# EAGLE design weight (EAGLE 9.5.0)
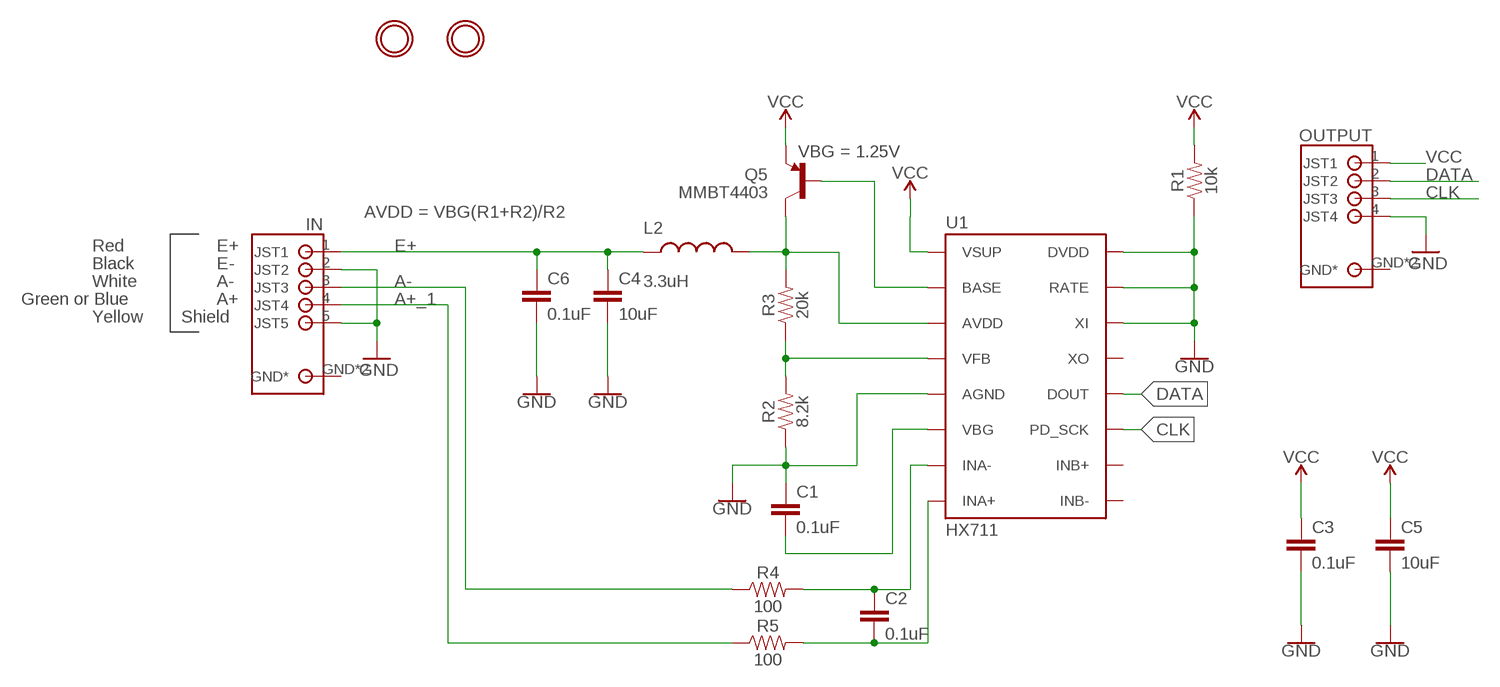
[diagram p0: schematic, sheet 1]

## Parts
C1  0.1uF  0.1UF-0603-25V-(+80/-20%)  [0603]
C2  0.1uF  0.1UF-0603-25V-(+80/-20%)  [0603]
C3  0.1uF  0.1UF-0603-25V-(+80/-20%)  [0603]
C4  10uF  10UF-0603-6.3V-20%  [0603]
C5  10uF  10UF-0603-6.3V-20%  [0603]
C6  0.1uF  0.1UF-0603-25V-(+80/-20%)  [0603]
IN  S5B-PH-SM4_TB  [S5B-PH-SM4_TB]
L2  3.3uH  INDUCTOR0805-IND  [0805]
OUTPUT  S4B-PH-SM4_TB  [S4B-PH-SM4_TB]
Q5  MMBT4403  TRANSISTOR_PNPMMBT4403  [SOT23-3]
R1  10k  10KOHM-0603-1/10W-1%  [0603]
R2  8.2k  8.2KOHM-0603-1/10W-5%  [0603]
R3  20k  20KOHM-0603-1/10W-1%  [0603]
R4  100  100OHM-0603-1/4W-5%  [0603]
R5  100  100OHM-0603-1/4W-5%  [0603]
U1  HX711  [SO16]
U$4  MOUNTINGHOLE2.5  [MOUNTINGHOLE_2.5_PLATED]
U$49  MOUNTINGHOLE2.5  [MOUNTINGHOLE_2.5_PLATED]

## Nets
A+_1: IN.4(JST4) R5.1
A-: IN.3(JST3) R4.1
CLK: OUTPUT.3(JST3) U1.11(PD_SCK)
DATA: OUTPUT.2(JST2) U1.12(DOUT)
E+: C4.1 C6.1 IN.1(JST1) L2.1
GND: C1.1 C3.2 C4.2 C5.2 C6.2 IN.2(JST2) IN.5(JST5) OUTPUT.4(JST4) R1.1 R2.1 U1.5(AGND) U1.14(XI) U1.15(RATE) U1.16(DVDD)
N$1: C2.2 R5.2 U1.8(INA+)
N$7: Q5.1(B) U1.2(BASE)
N$8: R2.2 R3.1 U1.4(VFB)
N$10: C1.2 U1.6(VBG)
N$11: L2.2 Q5.3(C) R3.2 U1.3(AVDD)
N$12: C2.1 R4.2 U1.7(INA-)
VCC: C3.1 C5.1 OUTPUT.1(JST1) Q5.2(E) R1.2 U1.1(VSUP)
Unconnected: IN.GND2(GND*) IN.GND(GND*) OUTPUT.GND2(GND*) OUTPUT.GND(GND*) U1.9(INB-) U1.10(INB+) U1.13(XO)

## Notes on the sheet
- VBG = 1.25V
- AVDD = VBG(R1+R2)/R2
- Red | E+
- Black | E-
- White | A-
- Green or Blue | A+
- Yellow | Shield

## Library data of the parts
C1-C3 C6 = SparkFun-Capacitors:0.1UF: 0.1µF ceramic capacitors A capacitor is a passive two-terminal electrical component used to store electrical energy temporarily in an electric field.; PROD_ID: CAP-00810
C4 C5 = SparkFun-Capacitors:10UF: 10.0µF ceramic capacitors A capacitor is a passive two-terminal electrical component used to store electrical energy temporarily in an electric field.; PROD_ID: CAP-11015
IN = NewKevinMade:S5B-PH-SM4_TB
L2 = SparkFun-Passives:INDUCTOR: Inductors Basic Inductor/Choke - 0603 and 1206. Footprints are not proven and vary greatly between part numbers. INDUCTOR POWER 3.3UH 4.0A SMD 0.197" L x 0.197" W x 0.177" H (5.00mm x 5.00mm x 4.50mm); PROD_ID: NDUC-13076
OUTPUT = NewKevinMade:S4B-PH-SM4_TB
Q5 = SparkFun-DiscreteSemi:TRANSISTOR_PNP: Generic PNP BJT Double check pinouts against datasheets- not all devices are the same! MMBT3906 - 40V 200mA SOT-23 (TRANS-08052) MMBT4403 - 40V 600mA SOT-23 (TRANS-09245); PROD_ID: TRANS-09245
R1 = SparkFun-Resistors:10KOHM: 10kΩ resistor A resistor is a passive two-terminal electrical component that implements electrical resistance as a circuit element. Resistors act to reduce current flow, and, at the same time, act to lower voltage levels within circuits. - Wikipedia; PROD_ID: RES-00824
R2 = SparkFun-Resistors:8.2KOHM: 8.2kΩ resistor A resistor is a passive two-terminal electrical component that implements electrical resistance as a circuit element. Resistors act to reduce current flow, and, at the same time, act to lower voltage levels within circuits. - Wikipedia; PROD_ID: RES-10646
R3 = SparkFun-Resistors:20KOHM: 20kΩ resistor A resistor is a passive two-terminal electrical component that implements electrical resistance as a circuit element. Resistors act to reduce current flow, and, at the same time, act to lower voltage levels within circuits. - Wikipedia; PROD_ID: RES-09383
R4 R5 = SparkFun-Resistors:100OHM: 100Ω resistor A resistor is a passive two-terminal electrical component that implements electrical resistance as a circuit element. Resistors act to reduce current flow, and, at the same time, act to lower voltage levels within circuits. - Wikipedia; PROD_ID: RES-12438
U1 = SparkFun-IC-Conversion:HX711: AVIA Semiconductor HX711 - ADC 24-Bit Analog-to-Digital Converter for Weigh Scales Datasheet <https://cdn.sparkfun.com/datasheets/Sensors/ForceFlex/hx711_english.pdf> SparkFun Products: SparkFun Load Cell Amplifier - HX711 <https://www.sparkfun.com/products/13879>; PROD_ID: IC-12445
U$4 U$49 = microbuilder:MOUNTINGHOLE: Mounting Hole For #2 screws (0.086"/2.18mm width, 0.094"/2.4mm hole) use 2.5mm; BOM: EXCLUDE

## Net classes
2 Power: width 0.203 mm, drill 0.203 mm, clearance 0.203 mm
3 HighSpeedSig: width 0.152 mm, drill 0.152 mm, clearance 0.203 mm
5 LowPower: width 0.203 mm, drill 0.203 mm, clearance 0.203 mm

## Board
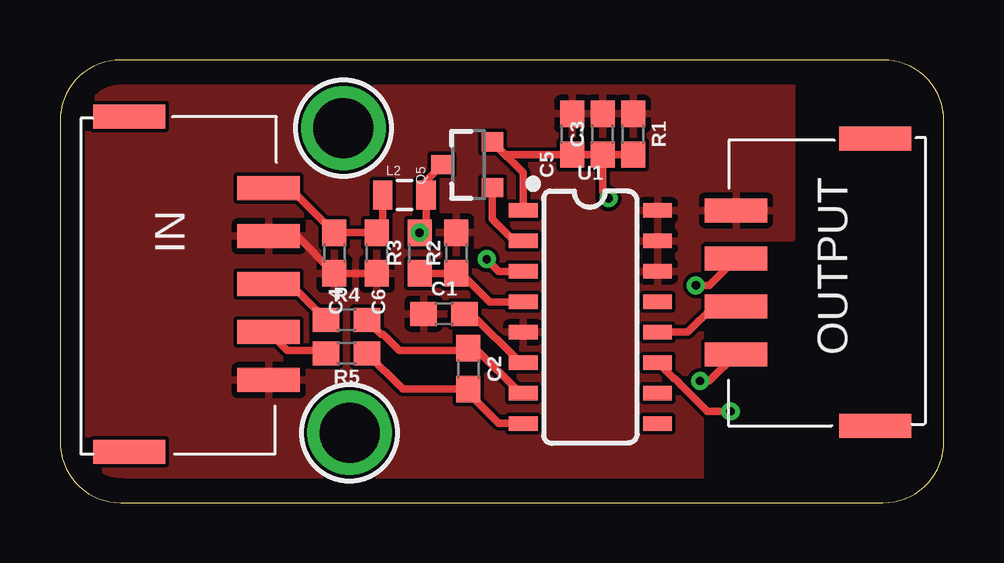
[diagram p1: board, top side]
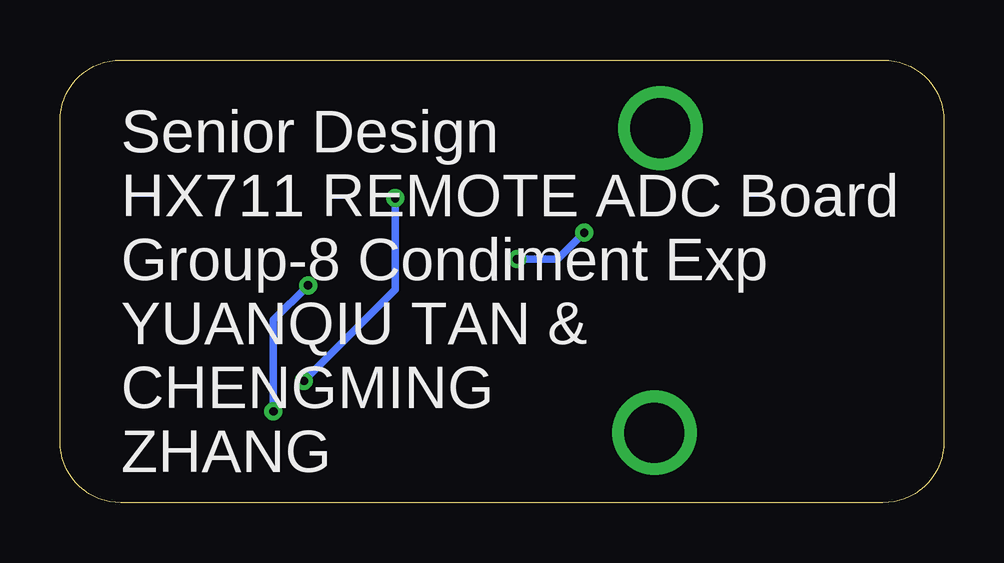
[diagram p2: board, bottom side, seen from below]

Size 36.83 x 18.47 mm. Coordinates in mm from the lower left corner, seen from the top.
Outline: 0,15.93 0,2.54 arc90 2.54,0 34.29,0 arc90 36.83,2.54 36.83,15.93 arc90 34.29,18.47 2.54,18.47 arc90 0,15.93
Copper layers (1*16): Top 0.035mm / dielectric 1.5mm / Bottom 0.035mm
Design rules "default": minimum track width 6mil, minimum drill 0.35mm, track to track 6mil, track to pad 6mil, pad to pad 6mil, via to via 6mil, smd to smd 6mil, copper to edge 40mil, drill to drill 6mil, minimum pad ring 10mil, minimum via ring 8mil, stop-mask expansion 4mil, vias tented up to drill 0mil, thermal gap 10mil

### Footprints (pad centres in the part's own frame; a part is rotated, then mirrored left to right if it is on the bottom)
0603 = smd 1.1 x 1: 1 -0.85,0; 2 0.85,0
S5B-PH-SM4_TB = smd 1 x 2.6: 1 4.92,9.33; 2 6.92,9.33; 3 8.92,9.33; 4 10.92,9.33; 5 12.92,9.33 | smd 1 x 3: GND 1.936,3.53; GND2 15.904,3.53
0805 = smd 0.8 x 1.2: 1 -0.9,0; 2 0.9,0
S4B-PH-SM4_TB = smd 1 x 2.6: 1 3.27,7.9; 2 5.27,7.9; 3 7.27,7.9; 4 9.27,7.9 | smd 1 x 3: GND 0.286,2.1; GND2 12.254,2.1
SOT23-3 = smd 0.8 x 0.9: 1 -0.95,-1; 2 0.95,-1; 3 0,1.1
SO16 = smd 0.6 x 1.2: 1 -4.445,-2.8; 2 -3.175,-2.8; 3 -1.905,-2.8; 4 -0.635,-2.8; 5 0.635,-2.8; 6 1.905,-2.8; 7 3.175,-2.8; 8 4.445,-2.8; 9 4.445,2.8; 10 3.175,2.8; 11 1.905,2.8; 12 0.635,2.8; 13 -0.635,2.8; 14 -1.905,2.8; 15 -3.175,2.8; 16 -4.445,2.8
MOUNTINGHOLE_2.5_PLATED = drill 2.5 pad 3.2: P$1 0,0

### Placement (x,y rotation side)
C1  16,7.87 0 top
C2  17.02,5.59 270 top
C3  22.61,15.37 90 top
C4  11.43,10.41 270 top
C5  21.34,15.37 90 top
C6  13.21,10.41 270 top
IN  -0.64,18.03 270 top
L2  14.35,12.83 0 top
OUTPUT  36.07,2.92 90 top
Q5  17.02,14.1 90 top
R1  23.88,15.37 270 top
R2  16.51,10.41 270 top
R3  14.99,10.41 90 top
R4  11.94,7.62 0 top
R5  11.94,6.22 0 top
U1  22.1,7.75 270 top
U$4  11.81,15.62 0 top
U$49  12.06,2.92 0 top

### Tracks (layer width: path | path; a pad name or v marks a point on that pad's centre or on a via)
A+_1
  Top 0.305: IN.4 9.46,6.35 10.96,6.35 R5.1
A-
  Top 0.305: IN.3 8.89,9.11 9.34,9.11 9.59,9.11 R4.1
CLK  (via drill 0.35)
  Top 0.305: OUTPUT.3 27.04,9.07 v26.49,9.07 | U1.11 25.56,5.18 25.62,5.18 25.8,5 25.8,4.98 26.97,3.81 v27.94,3.81
  Bottom 0.305: v26.49,9.07 27.94,7.62 v27.94,3.81
DATA
  Top 0.305: U1.12 26.16,7.11 27.24,8.19 OUTPUT.2
E+
  Top 0.305: IN.1 9.58,13.11 C4.1 C6.1 13.45,11.51 L2.1
GND
  Top 0.305: IN.2 9.88,11.11 C4.2 C6.2
  pour Top: 0,19.05 0,0 26.67,0 26.67,11.05 30.48,11.05 30.48,19.05
N$1
  Top 0.305: U1.8 18.29,3.3 17.02,4.57 C2.2 14.27,4.74 R5.2
N$7
  Top 0.305: U1.2 18.92,10.92 18.02,11.83 Q5.1
N$8
  Top 0.305: R3.1 R2.2 16.73,9.56 17.91,8.38 U1.4
N$10
  Top 0.305: C1.2 17.14,7.87 19.18,5.84 U1.6
N$11  (via drill 0.35)
  Top 0.305: U1.3 18.29,9.65 v17.78,10.16 | R3.2 15.25,11.53 L2.2 15.25,13.43 Q5.3
  Bottom 0.305: v17.78,10.16 16.09,10.16 R3.2
  other vias: 14.99,11.26
N$12
  Top 0.305: U1.7 19.17,4.57 17.3,6.44 C2.1 16.93,6.35 14.14,6.35 13.46,7.03 13.38,7.03 R4.2
VCC  (via drill 0.35)
  Top 0.305: U1.1 19.3,13.77 Q5.2 18.55,14.52 C5.1 C3.1 | R1.2 C3.1 | OUTPUT.1 27.06,5.08 v26.67,5.08 | v22.86,12.7 22.61,12.95 C3.1
  Bottom 0.305: v26.67,5.08 22.86,8.89 v22.86,12.7

### Text on the board
bNames: Senior Design / HX711 REMOTE ADC Board / Group-8 Condiment Exp / YUANQIU TAN & / CHENGMING / ZHANG